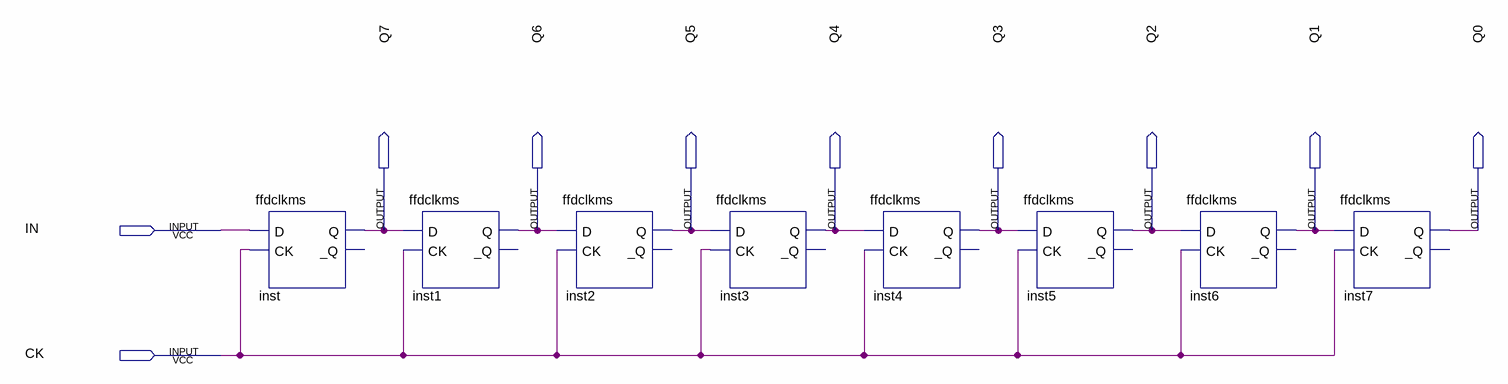
[diagram p0: schematic sheet]
// Quartus schematic registrador8bit.bdf as structural Verilog: 8 symbols, 10 pins
module registrador8bit (
  input  IN,
  input  CK,
  output Q7,
  output Q6,
  output Q5,
  output Q4,
  output Q3,
  output Q2,
  output Q1,
  output Q0
);

  ffdclkms inst (.D(IN), .CK(CK), .Q(Q7));  // open: _Q
  ffdclkms inst1 (.D(Q7), .CK(CK), .Q(Q6));  // open: _Q
  ffdclkms inst2 (.D(Q6), .CK(CK), .Q(Q5));  // open: _Q
  ffdclkms inst3 (.D(Q5), .CK(CK), .Q(Q4));  // open: _Q
  ffdclkms inst4 (.D(Q4), .CK(CK), .Q(Q3));  // open: _Q
  ffdclkms inst5 (.D(Q3), .CK(CK), .Q(Q2));  // open: _Q
  ffdclkms inst6 (.D(Q2), .CK(CK), .Q(Q1));  // open: _Q
  ffdclkms inst7 (.D(Q1), .CK(CK), .Q(Q0));  // open: _Q
endmodule
